# Altium schematic sheet main.SchDoc
size A4
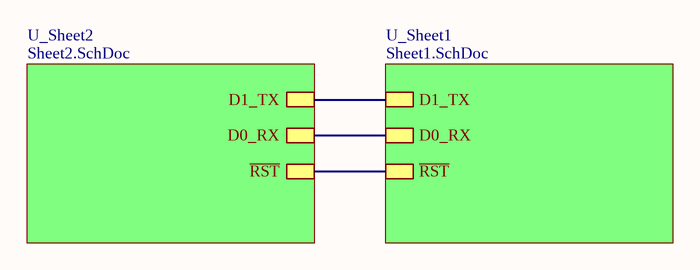
[diagram p0: main.SchDoc]

## Sub-sheets
U_Sheet1 = Sheet1.SchDoc: D1_TX, D0_RX, ~{RST}
U_Sheet2 = Sheet2.SchDoc: D1_TX, D0_RX, ~{RST}

## Nets
(unnamed): sheet U_Sheet1/D1_TX, sheet U_Sheet2/D1_TX
(unnamed): sheet U_Sheet1/D0_RX, sheet U_Sheet2/D0_RX
(unnamed): sheet U_Sheet1/~{RST}, sheet U_Sheet2/~{RST}